# Altium schematic sheet EBS_2020.SchDoc
size A2; Organization: Altium Limited; Address1: L3, 12a Rodborough Rd; Address2: Frenchs Forest; Address3: NSW; Address4: Australia 2086
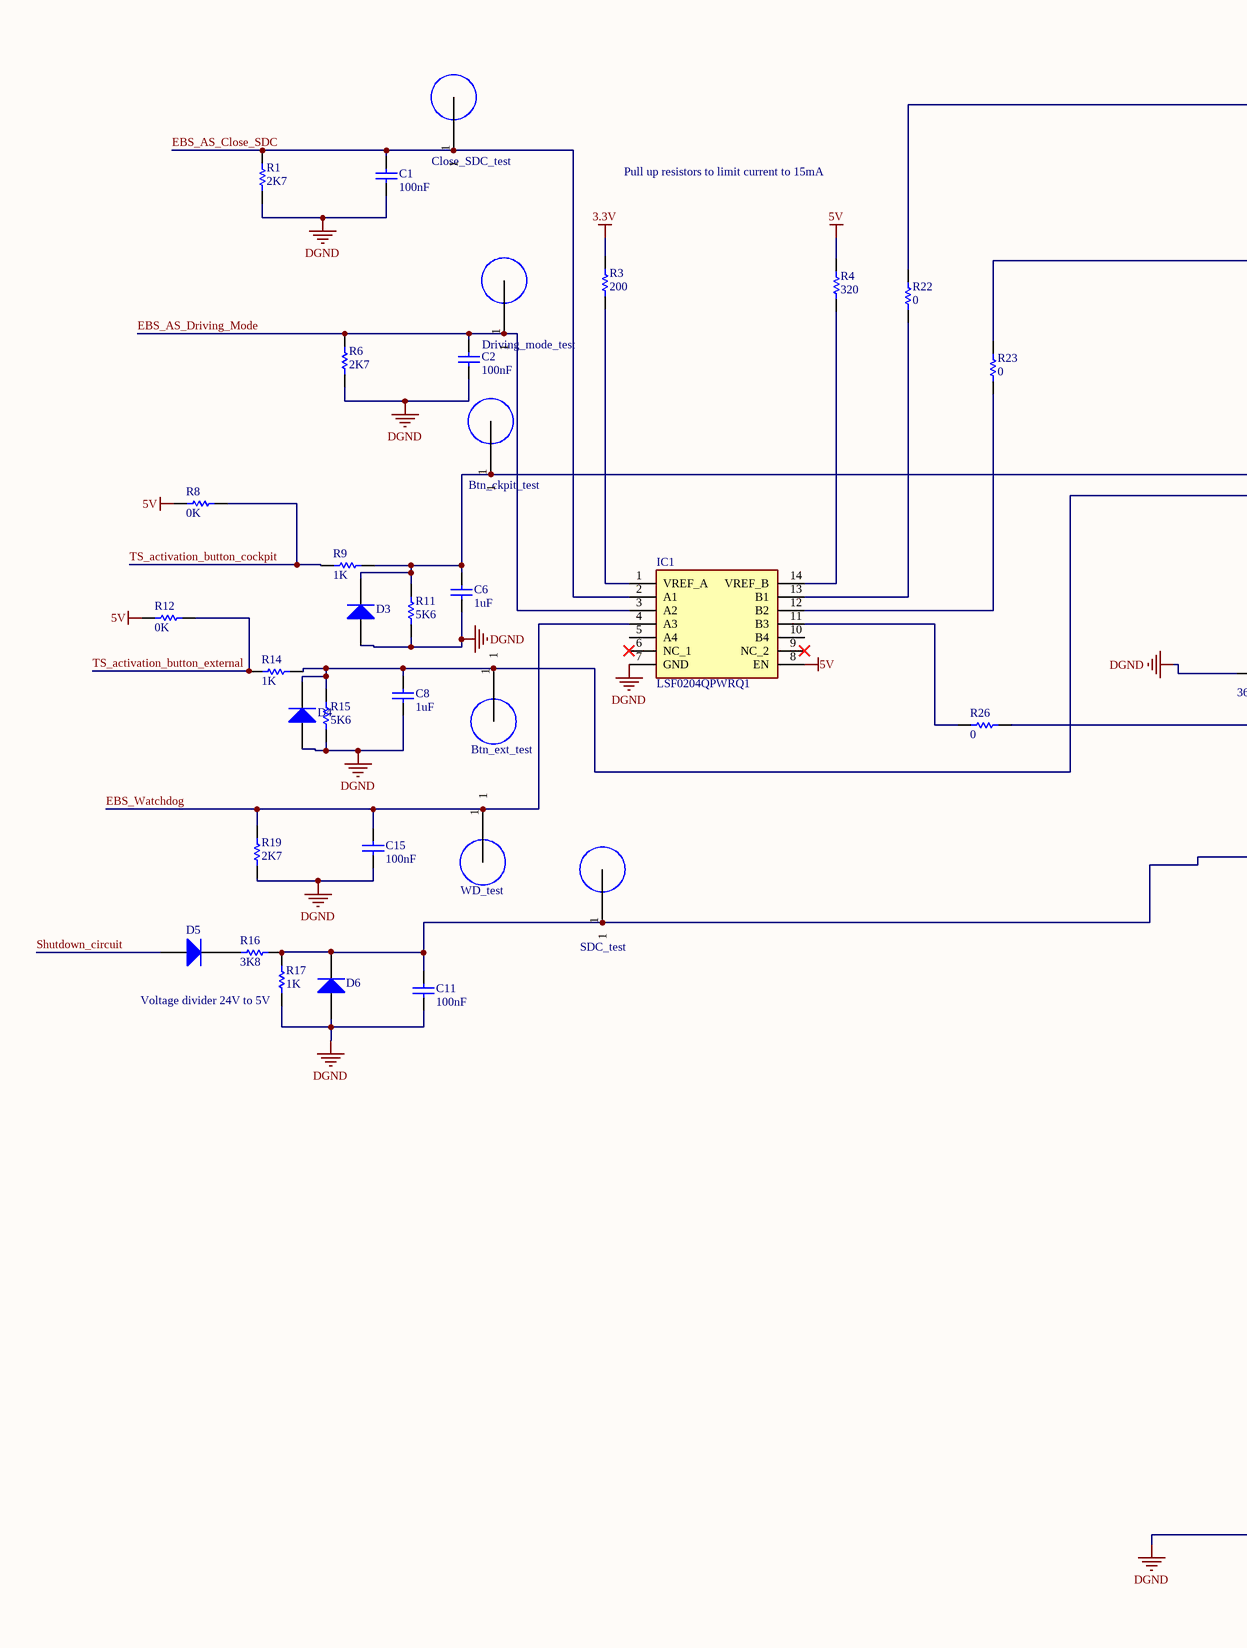
[diagram p0: EBS_2020.SchDoc, left]
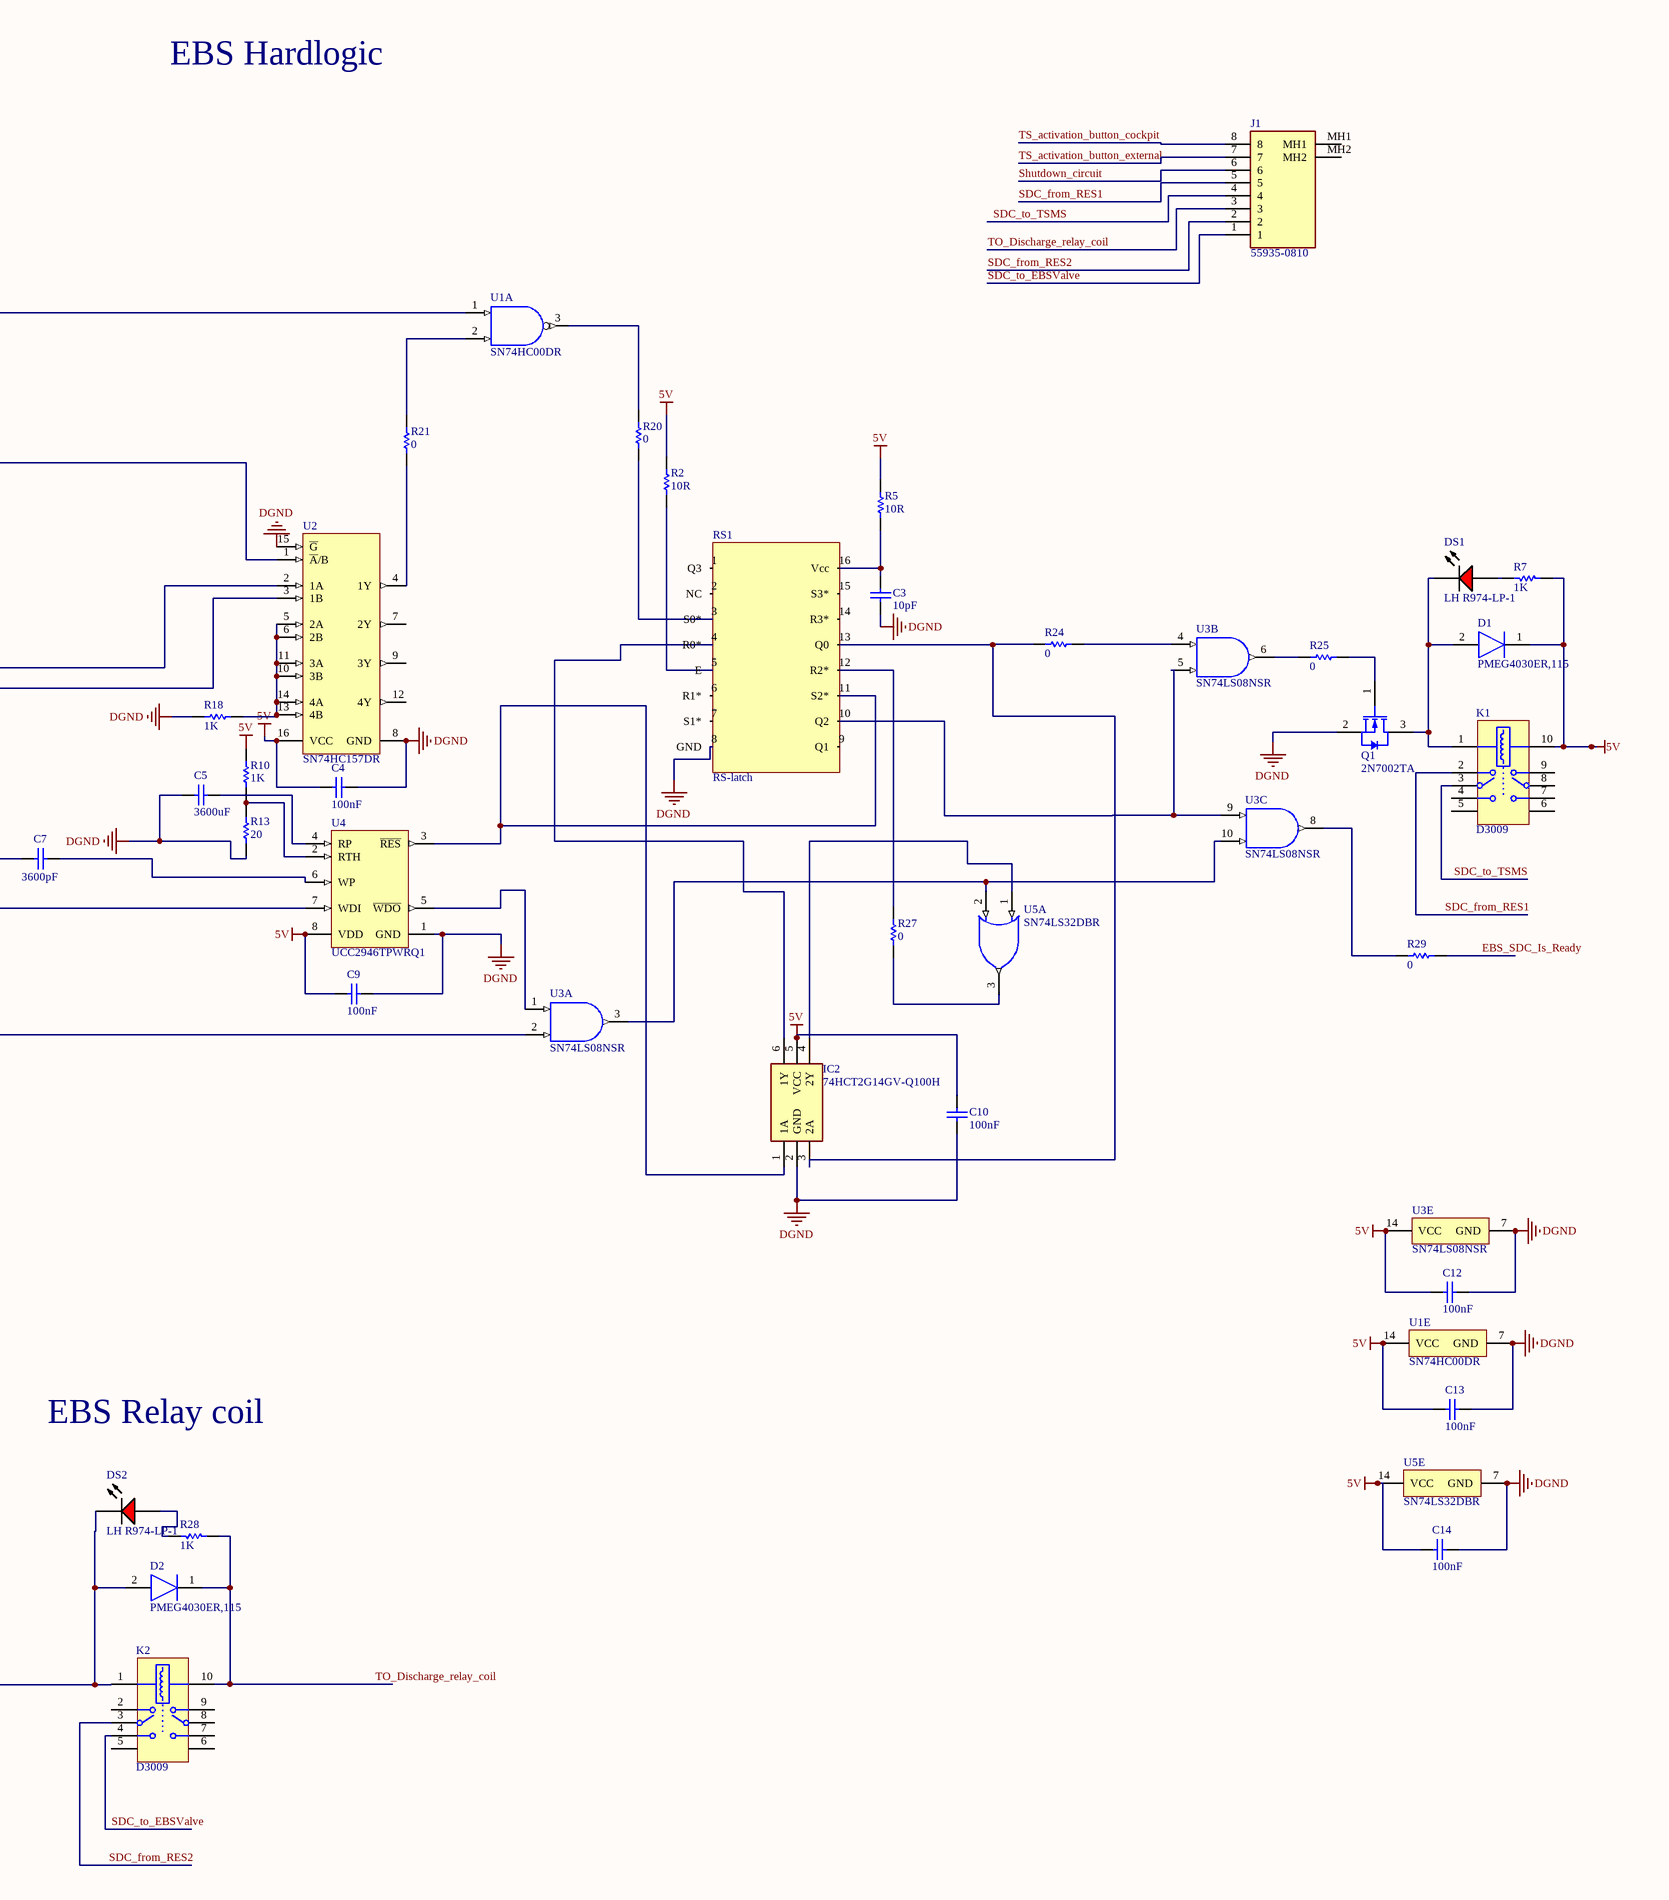
[diagram p1: EBS_2020.SchDoc, right]

## Parts
Btn_ckpit_test  MeasuringPoint  [MeasuringPoint]  (value not drawn)
Btn_ext_test  MeasuringPoint  [MeasuringPoint]  (value not drawn)
C1  100nF  [dV_C0805]
C2  100nF  [dV_C0805]
C3  10pF  [CAPC0805(2012)100_N]
C4  100nF  [dV_C0805]
C5  3600uF  [dV_C0805]
C6  1uF  [dV_C0805]
C7  3600pF  [dV_C0805]
C8  1uF  [dV_C0805]
C9  100nF  [dV_C0805]
C10  100nF  [dV_C0805]
C11  100nF  [dV_C0805]
C12  100nF  [dV_C0805]
C13  100nF  [dV_C0805]
C14  100nF  [dV_C0805]
C15  100nF  [dV_C0805]
Close_SDC_test  MeasuringPoint  [MeasuringPoint]  (value not drawn)
D1  PMEG4030ER,115  [SODFL3517X110N]
D2  PMEG4030ER,115  [SODFL3517X110N]
D3  (no value)  [1SMA12AT3G]
D4  (no value)  [1SMA12AT3G]
D5  (no value)  [1SMA12AT3G]
D6  (no value)  [1SMA12AT3G]
Driving_mode_test  MeasuringPoint  [MeasuringPoint]  (value not drawn)
DS1  LH R974-LP-1  [OSRM-LH R974_V]
DS2  LH R974-LP-1  [OSRM-LH R974_V]
IC1  LSF0204QPWRQ1  [SOP65P640X120-14N]
IC2  74HCT2G14GV-Q100H  [SOT95P275X110-6N]
J1  55935-0810  [559350810]
K1  D3009  [TECO-FP2-10_V]
K2  D3009  [TECO-FP2-10_V]
Q1  2N7002TA  [DIOD-SOT23-3_V]
R1  2K7  [dV_R0805]
R2  10R  [RESC0805(2012)_N]
R3  200  [dV_R0805]
R4  320  [dV_R0805]
R5  10R  [RESC0805(2012)_N]
R6  2K7  [dV_R0805]
R7  1K  [dV_R0805]
R8  0K  [dV_R0805]
R9  1K  [dV_R0805]
R10  1K  [dV_R0805]
R11  5K6  [dV_R0805]
R12  0K  [dV_R0805]
R13  20  [dV_R0805]
R14  1K  [dV_R0805]
R15  5K6  [dV_R0805]
R16  3K8  [dV_R0805]
R17  1K  [dV_R0805]
R18  1K  [dV_R0805]
R19  2K7  [dV_R0805]
R20  0  [dV_R0805]
R21  0  [dV_R0805]
R22  0  [dV_R0805]
R23  0  [dV_R0805]
R24  0  [dV_R0805]
R25  0  [dV_R0805]
R26  0  [dV_R0805]
R27  0  [dV_R0805]
R28  1K  [dV_R0805]
R29  0  [dV_R0805]
RS1  RS-latch  [SOIC127P600X175-16N]
SDC_test  MeasuringPoint  [MeasuringPoint]  (value not drawn)
U1  SN74HC00DR  [D0014A_M]  (parts A,E of 5)
U2  SN74HC157DR  [D0016A_M]
U3  SN74LS08NSR  [NS0014A_L]  (parts A,B,C,E of 5)
U4  UCC2946TPWRQ1  [PW8_N]
U5  SN74LS32DBR  [DB0014A_N]  (parts A,E of 5)
WD_test  MeasuringPoint  [MeasuringPoint]  (value not drawn)

## Nets
3.3V: R3.1
5V: C4.2 C9.2 C10.1 C12.2 C13.2 C14.2 D1.1(K) IC1.8(EN) IC2.5(VCC) K1.10 R2.2 R4.1 R5.2 R7.1 R8.2 R10.2 R12.2 U1.14(VCC) U2.16(VCC) U3.14(VCC) U4.8(VDD) U5.14(VCC)
DGND: C1.1 C2.1 C3.1 C4.1 C5.2 C6.1 C7.2 C8.1 C9.1 C10.2 C11.1 C12.1 C13.1 C14.1 C15.1 D2.2(A) D3.1(A) D4.1(A) D6.1(A) DS2.2(K) IC1.7(GND) IC2.2(GND) K2.1 Q1.2(S) R1.1 R6.1 R11.2 R13.1 R15.2 R17.1 R18.2 R19.1 RS1.8(GND) U1.7(GND) U2.8(GND) U2.15(~{G}) U3.7(GND) U4.1(GND) U5.7(GND)
EBS_AS_Close_SDC: C1.2 Close_SDC_test.1 IC1.2(A1) R1.2
EBS_AS_Driving_Mode: C2.2 Driving_mode_test.1 IC1.3(A2) R6.2
EBS_SDC_Is_Ready: R29.2
EBS_Watchdog: C15.2 IC1.4(A3) R19.2 WD_test.1
SDC_from_RES1: J1.5 K1.2
SDC_from_RES2: J1.2 K2.3
SDC_to_EBSValve: J1.1 K2.4
SDC_to_TSMS: J1.4 K1.3
Shutdown_circuit: D5.1(A) J1.6
TO_Discharge_relay_coil: D2.1(K) J1.3 K2.10 R28.1
TS_activation_button_cockpit: J1.8 R8.1 R9.2
TS_activation_button_external: J1.7 R12.1 R14.2
NetBtn_ckpit_test_1: Btn_ckpit_test.1 C6.2 D3.2(K) R9.1 R11.1 U2.2(1A)
NetBtn_ext_test_1: Btn_ext_test.1 C8.2 D4.2(K) R14.1 R15.1 U2.3(1B)
NetC3_2: C3.2 R5.1 RS1.16(Vcc)
NetC5_1: C5.1 U4.4(RP)
NetC7_1: C7.1 U4.6(WP)
NetC11_2: C11.2 D6.2(K) R16.1 R17.2 SDC_test.1 U3.2(1B)
NetD1_2: D1.2(A) DS1.2(K) K1.1 Q1.3(D)
NetD5_2: D5.2(K) R16.2
NetDS1_1: DS1.1(A) R7.2
NetDS2_1: DS2.1(A) R28.2
NetIC1_1: IC1.1(VREF_A) R3.2
NetIC1_11: IC1.11(B3) R26.1
NetIC1_12: IC1.12(B2) R23.2
NetIC1_13: IC1.13(B1) R22.2
NetIC1_14: IC1.14(VREF_B) R4.2
NetIC2_1: IC2.1(1A) RS1.11(S2*) U4.3(~{RES})
NetIC2_3: IC2.3(2A) R24.1 RS1.13(Q0)
NetIC2_4: IC2.4(2Y) U5.1(1A)
NetIC2_6: IC2.6(1Y) RS1.4(R0*)
NetQ1_1: Q1.1(G) R25.2
NetR2_1: R2.1 RS1.5(E)
NetR10_1: R10.1 R13.2 U4.2(RTH)
NetR18_1: R18.1 U2.5(2A) U2.6(2B) U2.10(3B) U2.11(3A) U2.13(4B) U2.14(4A)
NetR20_1: R20.1 U1.3(1Y)
NetR20_2: R20.2 RS1.3(S0*)
NetR21_1: R21.1 U1.2(1B)
NetR21_2: R21.2 U2.4(1Y)
NetR22_1: R22.1 U1.1(1A)
NetR23_1: R23.1 U2.1(~{A}/B)
NetR24_2: R24.2 U3.4(2A)
NetR25_1: R25.1 U3.6(2Y)
NetR26_2: R26.2 U4.7(WDI)
NetR27_1: R27.1 RS1.12(R2*)
NetR27_2: R27.2 U5.3(1Y)
NetR29_1: R29.1 U3.8(3Y)
NetRS1_10: RS1.10(Q2) U3.5(2B) U3.9(3A)
NetU3_1: U3.1(1A) U4.5(~{WDO})
NetU3_3: U3.3(1Y) U3.10(3B) U5.2(1B)

Not connected (* = marked no-connect by the designer): IC1 5(A4) 6(NC_1)* 9(NC_2)* 10(B4); J1 MH1 MH2; K1 4 5 6 7 8 9; K2 2 5 6 7 8 9; RS1 1(Q3) 2(NC) 6(R1*) 7(S1*) 9(Q1) 14(R3*) 15(S3*); U2 7(2Y) 9(3Y) 12(4Y)

## Notes on the sheet
- EBS Hardlogic
- Pull up resistors to limit current to 15mA
- (near R17) Voltage divider 24V to 5V
- EBS Relay coil
- Title
- Size:
- Date:
- A3
- Number:
- Time:
- Revision:
- Sheet
- of
- File:

## Library data of the parts
Btn_ckpit_test Btn_ext_test Close_SDC_test Driving_mode_test SDC_test WD_test = MeasuringPoint: 1,2mm hole for measuring purpose. Designator should be signal name.
C1 C2 C4-C6 C8-C15 = CMP-1036-04395-1: CAP 100nF 10V ±20% 0805 (2012 Metric) Thickness 0.75mm SMD; Case-Metric: 2012; Tolerance: Â±20%; Case-EIA: 0805; Max Thickness: 0.75 mm; Rated Voltage: 10 V; Value: 100nF; Technology: SMT
C3 = CMP-1036-00831-1: CAP 10pF 16V ±0.5pF 0805 (2012 Metric) Thickness 1mm SMD; Case-Metric: 2012; Tolerance: Â±0.5pF; Case-EIA: 0805; Max Thickness: 1 mm; Technology: SMT; Rated Voltage: 16 V; Value: 10pF
C7 = Cap: Manufacturer: KEMET; Manufacturer Part Number: C1206C362J5GACTU; Ceramic Capacitor Case: 0805 [2012 Metric]; Voltage Rating: 25; Capacitance Tolerance: ± 5%; Dielectric Characteristic: X8; Product Range: C Series; SVHC: No SVHC (15-Jun-2015)<!--FANDB--><div class="features-and-benefits-container"><div class="features-and-benefits-desc-container"><span class="features-and-benefits-container-desc">SMD Multilayer Ceramic Capacitor, 0805 [2012 Metric], 0.68 µF, 25 V, ± 5%, X8L, C Series</span></div><div class="features-and-benefits-description"><span class="features-benefits-value">The X8L dielectric features a 150°C maximum operating temperature and is considered "general purpose high temperature." These components are fixed, ceramic dielectric capacitors suited for high temperature bypass and decoupling applications or frequency discriminating circuits where Q and stability of capacitance characteristics are not critical. X8L exhibits a predictable change in capacitance with respect to time and voltage and boasts a minimal change in capacitance with reference to ambient temperature up to 125°C. Beyond 125°C X8L displays a wider variation in capacitance. Capacitance change is limited to ±15% from ?55°C to +125°C and +15, ?40% from 125°C to 150°C.</span></div><div class="features-and-benefits-list"><ul class="features-and-benefits-list-list"><li class="features-and-benefits-list-item">Operating temperature range from -55°C to 150°C</li><li class="features-and-benefits-list-item">Capacitance values ranging from 0.012µF to 10µF</li><li class="features-and-benefits-list-item">EIA 0402, 0603, 0805, 1206 and 1210 case sizes available</li><li class="features-and-benefits-list-item">DC voltage rating of 10V, 16V, 25V and 50; Temp Coeff (Dielectric): C0G; Voltage: 50VDC; Wire Form: Not Required; Case Style: Ceramic Chip; Product Length (mm): 3.2mm; Product Diameter (mm): Not Requiredmm; Product Depth (mm): 1.6mm; Tolerance (+ or -): 5%; Product Height (mm): 0.9mm; Supplier 1: Farnell; Supplier Part Number 1: 2933073; RoHS: YES; Stock 1: 576; Pricing 1: 5=0.718, 50=0.419, 250=0.279, 500=0.228, 1000=0.193, 2500=0.186, 12500=0.179 (GBP); Capacitance: 3600pF; Packaging: Tape and Reel; Operating Temperature Min: -55; Operating Temperature Max: 150; Automotive Qualification Standard: -; MSL: MSL 1 - Unlimited; ComponentLink1URL: http://www.farnell.com/datasheets/2321109.pdf; ComponentLink1Description: http://www.farnell.com/datasheets/2321109.pdf; ComponentLink2URL: https://youtu.be/PxmtxV5n2KM?list=PLa3x8V-ZYWEUNRPUyCTjknYUhI9vvDZu9; ComponentLink2Description: https://youtu.be/PxmtxV5n2KM?list=PLa3x8V-ZYWEUNRPUyCTjknYUhI9vvDZu9; ComponentLink3URL: http://www.farnell.com/datasheets/2315665.pdf; ComponentLink3Description: http://www.farnell.com/datasheets/2315665.pdf; ComponentLink4URL: http://www.farnell.com/cad/2268906.zip; ComponentLink4Description: http://www.farnell.com/cad/2268906.zip; Operating Temp Range: -55C to 125C; Supplier: Mouser; Mounting Style: Surface Mount; Supplier Part Number: 80-C1206C362J5G; Construction: SMT Chip; Package / Case: 1206; Failure Rate: Not Required
D1 D2 = PMEG4030ER,115: Diode; Manufacturer_Name: Nexperia; Datasheet Link: https://componentsearchengine.com/Datasheets/1/PMEG4030ER,115.pdf; Height: 1.1mm; Mouser2 Part Number: 771-PMEG4030ER115; Mouser2 Price/Stock: https://www.mouser.com/Search/Refine.aspx?Keyword=771-PMEG4030ER115; Manufacturer_Part_Number: PMEG4030ER,115
D3-D6 = Diode 1N914: High Conductance Fast Diode; Manufacturer: PANASONIC ELECTRONIC COMPONENTS; Manufacturer Part Number: DB2W31900L; Repetitive Reverse Voltage Vrrm Max: 30; Forward Current If(AV): 3; Diode Configuration: Single; Diode Case Style: SOD-123; No. of Pins: 2; Forward Voltage VF Max: 490; Product Range: DB2W3 Series; SVHC: No SVHC (07-Jul-2017); Diode Type: Ultrafast Recovery; Reverse Recovery Time trr Max: 23; Semiconductor Technology: Si<!--FANDB--><div class="features-and-benefits-container"><div class="features-and-benefits-desc-container"><span class="features-and-benefits-container-desc">Schottky Rectifier, 30 V, 3 A, Single, SOD-123F, 2 Pins, 490 mV</span></div><div class="features-and-benefits-description"><span class="features-benefits-value">The DB2W31900L is a silicon epitaxial planar Schottky Barrier Diode suitable for rectification.</span></div><div class="features-and-benefits-list"><ul class="features-and-benefits-list-list"><li class="features-and-benefits-list-item">Low forward-voltage VF</li><li class="features-and-benefits-list-item">Low terminal capacitance Ct</li><li class="features-and-benefits-list-item">Halogen-free</li><li class="features-and-benefits-list-item">MSL 1 Compliant</li><li class="features-and-benefits-list-item">UL94V-0 Flammability rating</li></ul></div><div class="features-and-benefits-applications"><ul class="features-and-benefits-value"><li class="features-and-benefits-list-item">Industrial</li></ul></div></div>; Supplier 1: Farnell; Supplier Part Number 1: 2284956; RoHS: YES; Stock 1: 13109; Pricing 1: 5=0.428, 25=0.399, 100=0.194, 250=0.17, 500=0.136, 1000=0.115, 5000=0.101 (GBP); ComponentLink1URL: http://www.farnell.com/datasheets/1912069.pdf; ComponentLink1Description: http://www.farnell.com/datasheets/1912069.pdf; Forward Surge Current Ifsm Max: 30; Operating Temperature Max: 125; Packaging: Each; Automotive Qualification Standard: -; MSL: MSL 1 - Unlimited
DS1 DS2 = CMP-2000-06540-1: LED Uni-Color Red, 1.8 V, -30 to 85 degC, 2-Pin SMD, RoHS, Tape and Reel; Manufacturer: OSRAM; Dominant Wave Length: 645nm; Peak Wavelength: 660nm; Chip Material: GaAlAs; Main Category: ChipLED; Luminous Intensity: 71mcd; Rad Hardened: No; Product Depth (mm): 1.35mm; Test Current (It): 20mA; Lens Type: ColorlessDiffused; Forward Current: 30mA; Viewing Angle: 160deg; Product Length (mm): 2.1mm; Reverse Voltage: 5V; Number of  Elements: 1; Luminous Flux: 0.17lm; Shape Type: Rectangular; Product Height (mm): 0.9mm; Forward Voltage: 2.6V; Package Description: 2-Pin Surface Mount Device, Body 1.25 x 2 mm; Operating Temperature Classification: Commercial; Emitting Color: Red; Pin Count: 2; Type: Uni-Color; Packaging: TapeandReel; High Brightness: No; Datasheet URL: https://datasheet.ciiva.com/26941/getdatasheetpartid-258950-26941914.pdf; Operating Temp Range: -30Cto85C; Lens Dimensions: 1.4x1.35x0.5mm; Package Type: ChipLed; Datasheet Version: Rev. 1.0, 11/2012; Mounting Technology: SurfaceMount; Manufacturer URL: https://www.osram.com/corporate/; Package Reference: LH R974; Mounting: SurfaceMount
IC1 = LSF0204QPWRQ1: Integrated Circuit; Manufacturer_Name: Texas Instruments; Datasheet Link: http://www.ti.com/lit/gpn/lsf0204-q1; Height: 1.2mm; Mouser2 Part Number: 595-LSF0204QPWRQ1; Mouser2 Price/Stock: https://www.mouser.com/Search/Refine.aspx?Keyword=595-LSF0204QPWRQ1; Manufacturer_Part_Number: LSF0204QPWRQ1
IC2 = 74HCT2G14GV-Q100H: Integrated Circuit; Manufacturer_Name: Nexperia; Datasheet Link: https://assets.nexperia.com/documents/data-sheet/74HC_HCT2G14_Q100.pdf; Height: 1.1mm; Manufacturer_Part_Number: 74HCT2G14GV-Q100H
J1 = 55935-0810: Connector; Manufacturer_Name: Molex; Datasheet Link: https://www.molex.com/pdm_docs/sd/559350810_sd.pdf; Height: 6.7mm; Manufacturer_Part_Number: 55935-0810
K1 K2 = CMP-0439-00017-1: 2 Form C, Monostable FP2 Relay, 2 A, 5 V, 10-Pin THT(FP2), RoHS, Tube; Manufacturer: TE Connectivity; Minimum Switching Voltage: 100 uV; Contact Arrangement: 2 form C (CO); Switching Current: 2 A; Max. Coil Temperature: 125 degC; Rated Voltage: 5 V; Thermal Resistance: <125 K/W; Rated Coil Power: 140 mW; Perf. Type: Standard; PackageDescription: 10-Pin FP2, Body 9 x 14 mm, Pitch 2.54 mm; ComponentLink2Description: Datasheet; ComponentLink2URL: http://www.te.com/commerce/DocumentDelivery/DDEController?Action=showdoc&DocId=Specification+Or+Standard%7F108-98005%7FK%7Fpdf%7FEnglish%7FENG_SS_108-98005_K.pdf; ComponentLink1Description: Manufacturer URL; ComponentLink3Description: Package Specification; DatasheetVersion: Rev. 1012; ComponentLink3URL: http://www.te.com/commerce/DocumentDelivery/DDEController?Action=showdoc&DocId=Customer+Drawing%7F1462033-2%7FA5%7Fpdf%7FEnglish%7FENG_CD_1462033-2_A5_1462033-2.pdf; PackageReference: FP2-10; Packing: Tube; PartNumber: D3009; ComponentLink1URL: http://www.te.com/; Mounting Technology: Through Hole; PackageVersion: Rev. A5; RoHS: TRUE; Coil Type: Monostable
Q1 = CMP-2000-05566-1: N-Channel Enhancement Mode Field Effect Transistor, 60 V, 0.3 W, -55 to 150 degC, 3-Pin SOT23, Pb-Free, Tape and Reel; Manufacturer: DiodesIncorporated; Transistor Type: 1N-Channel; Typical Turn-Off Delay Time: 11ns; Vds - Drain-Source Breakdown Voltage: 60V; Pd - Power Dissipation: 330mW; Id - Continuous Drain Current: 115mA; Rds On - Drain-Source Resistance: 7.5Ohms; Number of Channels: 1Channel; Vgs - Gate-Source Voltage: 40V; Type: FET; Configuration: Single; Unit Weight: 0.000282oz; Typical Turn-On Delay Time: 7ns; Factory Pack Quantity: 3000; Series: 2N7002; Package Description: 3-Pin Small Outline Transistor, Body 2.9 x 1.3 mm, Pitch 0.96 mm; Datasheet URL: https://datasheet.ciiva.com/15137/getdatasheetpartid-85857-15137606.pdf; Packaging: Reel; &lt;PCN&gt;: http://www.mouser.com/PCN/Diodes_Inc_2165.pdf; Package / Case: SOT-23-3; Mounting Style: SMD/SMT; Brand: DiodesIncorporated; Maximum Operating Temperature: +150C; Technology: Si; Datasheet Version: Rev. 24-2, 11/2010; Package Reference: SOT23-3; Channel Mode: Enhancement; Mounting Technology: SurfaceMount; Transistor Polarity: N-Channel; Product Category: MOSFET; RoHS: True; Width: 1.3mm; Height: 1mm; Product: MOSFETSmallSignal; Length: 2.9mm; Manufacturer URL: http://www.diodes.com/; Minimum Operating Temperature: -55C
R1 R3 R4 R6 R8-R27 R29 = CMP-1013-00557-1: 2K7 0.125W 1% 0805 (2012 Metric)  SMD; Case-EIA: 0805; Value: 2700.00 Ohm; Case-Metric: 2012; Tolerance: 1 %; Power: 0.125 W; Technology: SMT
R2 R5 = CMP-1013-00284-1: 10R 0.125W 1% 0805 (2012 Metric)  SMD; Case-Metric: 2012; Value: 10.00 Ohm; Case-EIA: 0805; Tolerance: 1 %; Technology: SMT; Power: 0.125 W
R7 R28 = CMP-1013-00510-1: 1K 0.125W 1% 0805 (2012 Metric)  SMD; Case-Metric: 2012; Value: 1000.00 Ohm; Case-EIA: 0805; Tolerance: 1 %; Power: 0.125 W; Technology: SMT
RS1 = RS-latch: MC14044B
U1 = CMP-1622-00008-2: Quad 2-Input Positive-NAND Gates, D0014A, LARGE T&R; Manufacturer: Texas Instruments; VCC(Max)(V): 6; Technology Family: HC; Schmitt Trigger: Yes; ICC @ Nom Voltage(Max)(mA): 0.02; F @ Nom Voltage(Max)(Mhz): 70; Bits(#): 4; Input Type: CMOS; Output Drive (IOL/IOH)(Max)(mA): 5.2/-5.2; Voltage(Nom)(V): 5; VCC(Min)(V): 2; Rating: Catalog; tpd @ Nom Voltage(Max)(ns): 23; Generic Part Number: SN74HC00; Code_JEDEC: MS-012; PackageReference: D0014A; DatasheetVersion: SCLS181E; Operating Temperature Range(C): -40 to 85; Output Type: CMOS
U2 = CMP-1628-00003-2: Quadruple 2-Line To 1-Line Data Selectors/Multiplexers, D0016A, LARGE T&R; Manufacturer: Texas Instruments; Voltage(Nom)(V): 3.3,5; Configuration: 2：1; Rating: Catalog; ICC @ Nom Voltage(Max)(mA): 10; Input Type: LVTTL/CMOS; Function: Encoder/Multiplexer; Technology Family: HC; tpd @ Nom Voltage(Max)(ns): 32; Output Type: CMOS; Channels(#): 4; VCC(Min)(V): 2; VCC(Max)(V): 6; Output Drive (IOL/IOH)(Max)(mA): 7.8/-7.8; F @ Nom Voltage(Max)(Mhz): 28; Schmitt Trigger: No; DatasheetVersion: SCLS113D; PackageReference: D0016A; Generic Part Number: SN74HC157; Operating Temperature Range(C): -40 to 85; Code_JEDEC: MS-012 variation AC; Type: Standard; Bits(#): 2
U3 = CMP-0777-00305-4: Quadruple 2-Input Positive-AND Gates, NS0014A, LARGE T&R; Manufacturer: Texas Instruments; Output Type: TTL; ICC @ Nom Voltage(Max)(mA): 0.021; VCC(Max)(V): 5.25; Output Drive (IOL/IOH)(Max)(mA): -0.8/16; Technology Family: LS; Voltage(Nom)(V): 5; tpd @ Nom Voltage(Max)(ns): 25; Bits(#): 4; Schmitt Trigger: No; VCC(Min)(V): 4.75; F @ Nom Voltage(Max)(Mhz): 35; Rating: Catalog; Operating Temperature Range(C): 0 to 70; PackageReference: NS0014A; Input Type: TTL; DatasheetVersion: SDLS033; Generic Part Number: SN74LS08
U4 = UCC2946TPWRQ1: Automotive Catalog Microprocessor Supervisor with Watchdog Timer, 1 Supply Monitored, -40 to 105 degC, 8-pin TSSOP (PW), Green (RoHS & no Sb/Br); Manufacturer: Texas Instruments; # of supplies monitored: 1; Iq(Typ)(uA): 12; Output Driver Type / Reset Output: Active-low, Push-pull; Reset Threshold Accuracy(%): 2; SubFamily: Supervisor and Reset IC; Threshold Voltage 1 (typ)(Typ)(V): 1.235; Time Delay(ms): Programmable; VCC(Max)(V): 5.5; VCC(Min)(V): 2.1; DatasheetVersion: SGLS273B; PackageVersion: revG, Feb-2011; PackageReference: PW8; PackageDescription: 8-Pin Plastic Thin Small Outline Package 3 x 4.4 mm Body ,0.65 mm Pitch; Supplier 1: Digi-Key; Supplier Part Number 1: 296-23028-2-ND; Supplier 2: Digi-Key; Supplier Part Number 2: 296-23028-1-ND; Supplier 3: Digi-Key; Supplier Part Number 3: 296-23028-6-ND; Supplier 4: Newark; Supplier Part Number 4: 73J8423; Supplier 5: Mouser; Supplier Part Number 5: 595-UCC2946TPWRQ1; Rating: Automotive; Watchdog Timer WDI(sec): Programmable; Mounting Technology: Surface Mount; Code_JEDEC: MO-153; PartNumber: UCC2946TPWRQ1; ComponentLink1Description: Datasheet; ComponentLink1URL: http://www.ti.com/general/docs/lit/getliterature.tsp?genericPartNumber=UCC2946-Q1&fileType=pdf
U5 = CMP-1573-00077-3: Quad 2-input positive-OR gates, DB0014A, LARGE T&R; Manufacturer: Texas Instruments; F @ Nom Voltage(Max)(Mhz): 35; Voltage(Nom)(V): 5; Bits(#): 4; VCC(Max)(V): 5.25; Output Type: TTL; VCC(Min)(V): 4.75; ICC @ Nom Voltage(Max)(mA): 0.038; Output Drive (IOL/IOH)(Max)(mA): 0.8/-16; tpd @ Nom Voltage(Max)(ns): 22; Rating: Catalog; PackageReference: DB0014A; Operating Temperature Range(C): 0 to 70; DatasheetVersion: SDLS100; PackageVersion: http://www.ti.com/lit/ml/msso002e/msso002e.pdf; Generic Part Number: SN74LS32; Code_JEDEC: MO-150; Input Type: TTL